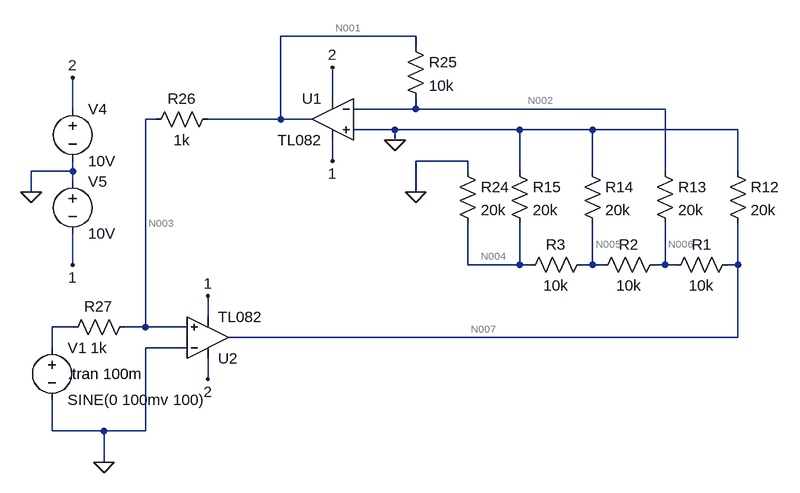
[diagram p0: schematic sxematic.asc]
* sxematic.asc
R2 N006 N005 10k
R3 N005 N004 10k
R1 N007 N006 10k
R24 0 N004 20k
R25 N001 N002 10k
R26 N001 N003 1k
R27 N003 N008 1k
R15 0 N004 20k
R14 0 N005 20k
R13 N002 N006 20k
R12 0 N007 20k
V1 N008 0 SINE(0 100mv 100)
* U1: TL082 (symbol TL082 not available, pins judged from their places): In+=0 In-=N002 V+=2 V-=1 OUT=N001
* U2: TL082 (symbol TL082 not available, pins judged from their places): In+=N003 In-=0 V+=2 V-=1 OUT=N007
V4 2 0 10V
V5 0 1 10V
.tran 100m
.backanno
.end

* Results of the author's LTspice run, read from the files saved beside the schematic
* Operating Point, zero values left out:
*   V(n006) = 77.51 µV
*   V(n005) = 38.76 µV
*   V(n004) = 19.38 µV
*   V(n007) = 149.5 µV
*   V(n001) = -21.9 µV
*   V(n002) = 10.97 µV
*   V(n003) = -10.97 µV
*   V(1) = -10 V
*   V(2) = 10 V
*   I(R12) = -7.477 nA
*   I(R13) = -3.327 nA
*   I(R14) = -1.938 nA
*   I(R15) = -968.9 pA
*   I(R27) = -10.97 nA
*   I(R26) = -10.93 nA
*   I(R25) = -3.287 nA
*   I(R24) = -968.9 pA
*   I(R1) = 7.203 nA
*   I(R3) = 1.938 nA
*   I(R2) = 3.876 nA
*   I(V5) = -19.06 mA
*   I(V4) = -19.06 mA
*   I(V1) = -10.97 nA
*   Ix(u1:1) = 40.05 pA
*   Ix(u1:2) = 40.05 pA
*   Ix(u1:3) = 9.528 mA
*   Ix(u1:4) = -9.528 mA
*   Ix(u1:5) = 14.22 nA
*   Ix(u2:1) = 40.05 pA
*   Ix(u2:2) = 40.05 pA
*   Ix(u2:3) = 9.528 mA
*   Ix(u2:4) = -9.528 mA
*   Ix(u2:5) = -14.68 nA
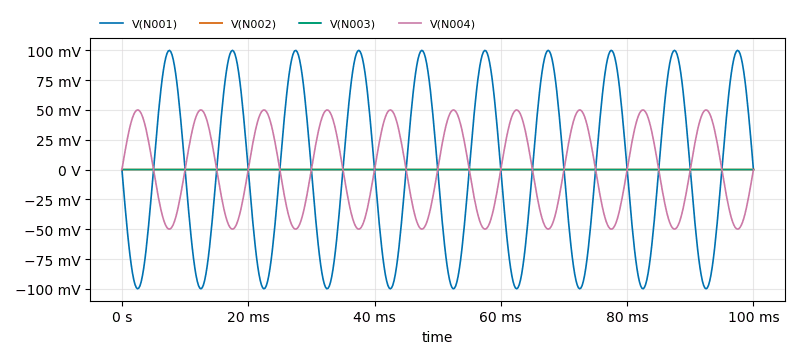
[diagram p1: Transient Analysis of sxematic.asc, plotted from the saved traces]
* Transient Analysis, 1 run:
*   V(N001): min -99.92 mV, max 99.88 mV, average -21.73 µV, rms 70.65 mV, last 1.661 µV
*   V(N002): min 7.545 µV, max 14.48 µV, average 10.97 µV, rms 11.24 µV, last 14.35 µV
*   V(N003): min -22.87 µV, max 1.168 µV, average -10.97 µV, rms 13.83 µV, last 810.3 nV
*   V(N004): min -49.93 mV, max 49.97 mV, average 19.29 µV, rms 35.33 mV, last 10.13 µV